# EAGLE design keyboard-tester (EAGLE 7.3.0)
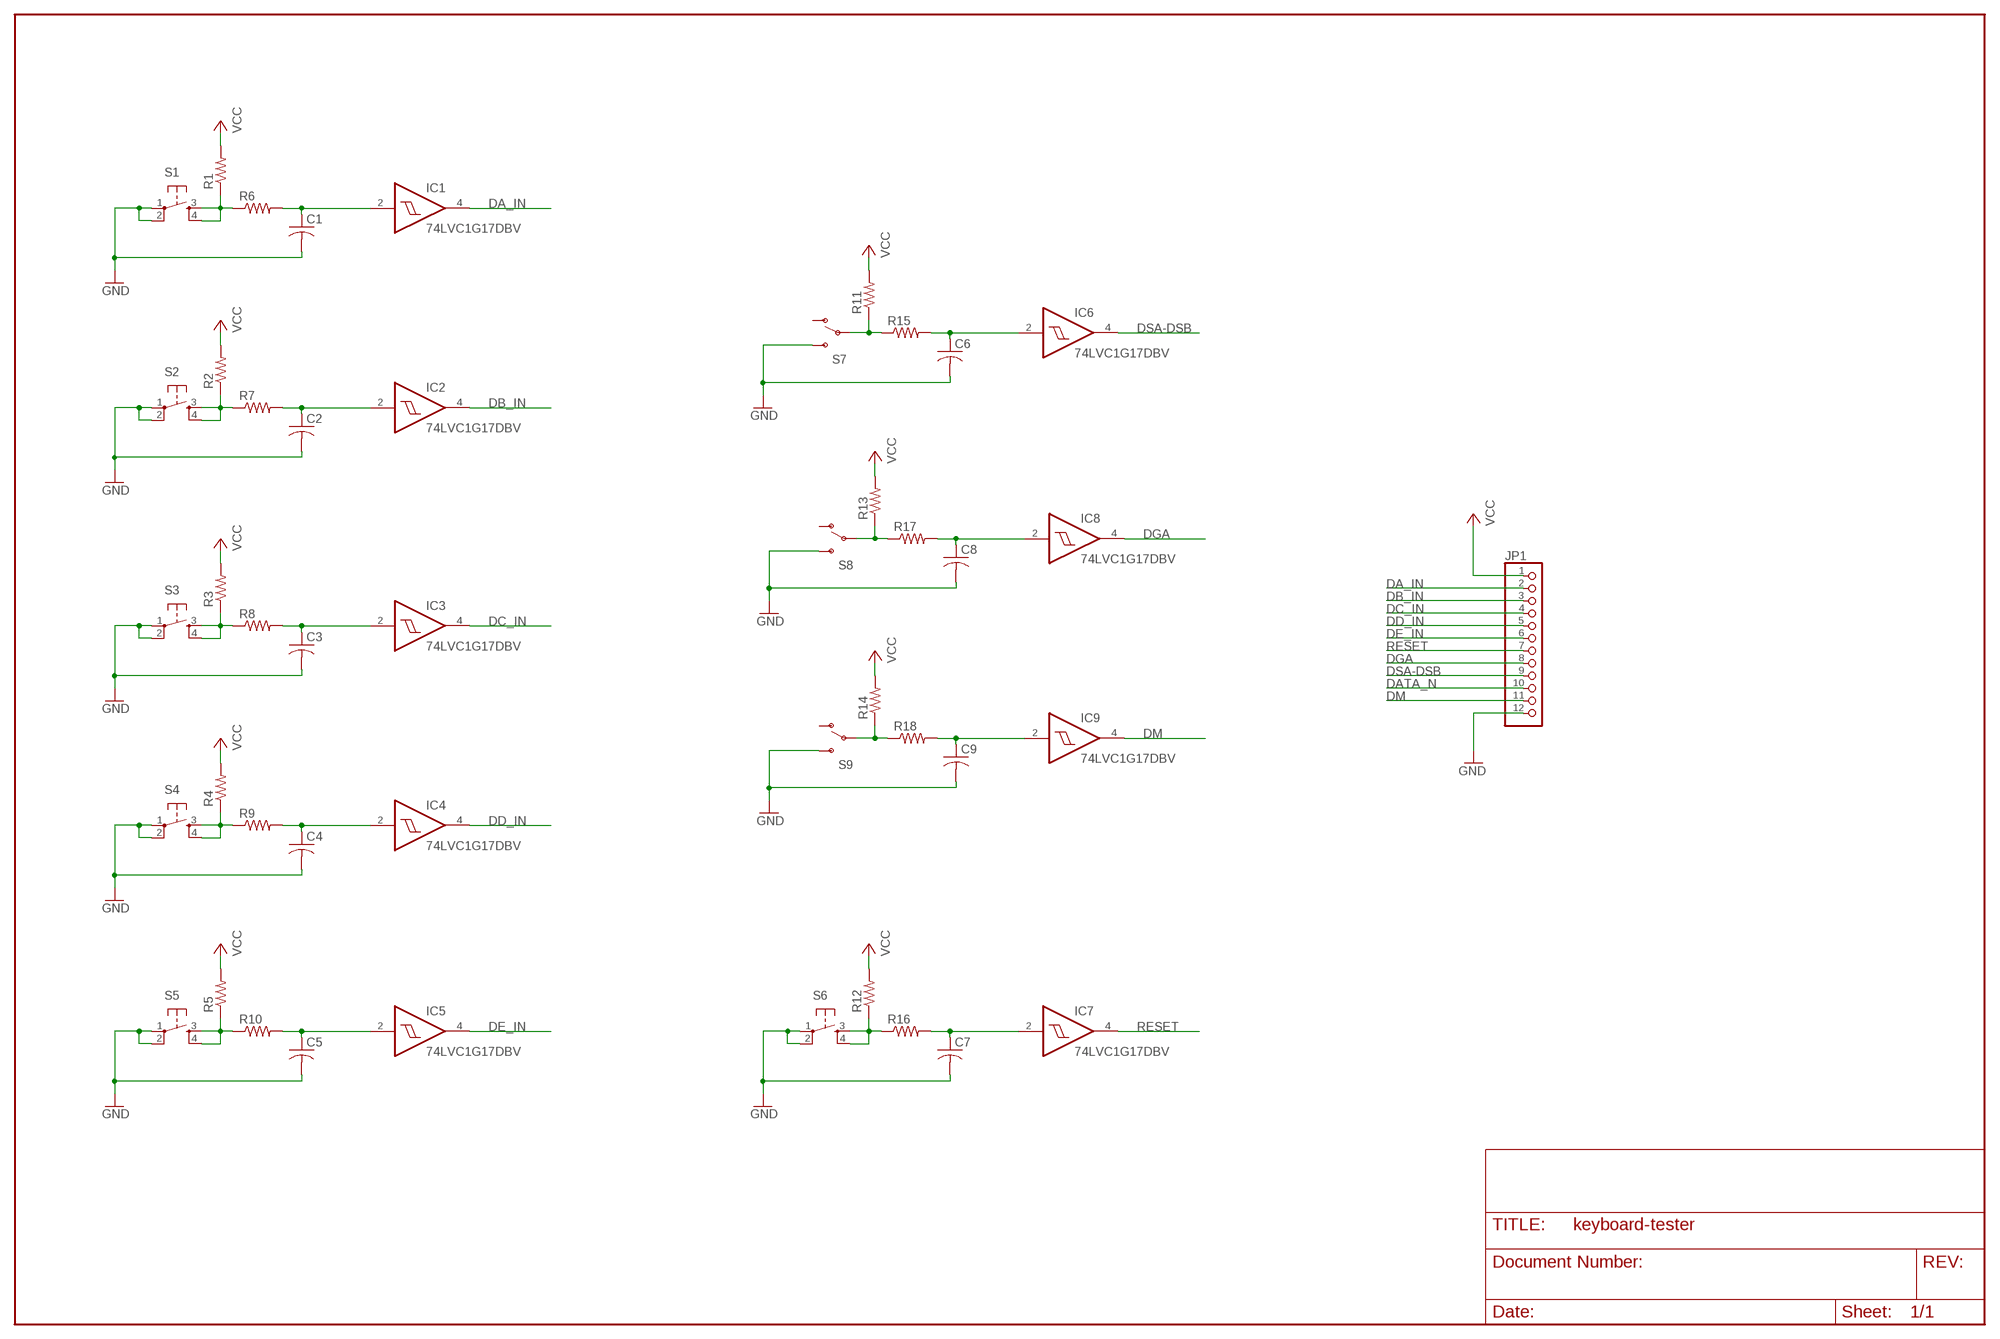
[diagram p0: schematic, sheet 1]

## Parts
C1  C-USC0805  [C0805]
C2  C-USC0805  [C0805]
C3  C-USC0805  [C0805]
C4  C-USC0805  [C0805]
C5  C-USC0805  [C0805]
C6  C-USC0805  [C0805]
C7  C-USC0805  [C0805]
C8  C-USC0805  [C0805]
C9  C-USC0805  [C0805]
IC1  74LVC1G17DBV  [SOT23-5]
IC2  74LVC1G17DBV  [SOT23-5]
IC3  74LVC1G17DBV  [SOT23-5]
IC4  74LVC1G17DBV  [SOT23-5]
IC5  74LVC1G17DBV  [SOT23-5]
IC6  74LVC1G17DBV  [SOT23-5]
IC7  74LVC1G17DBV  [SOT23-5]
IC8  74LVC1G17DBV  [SOT23-5]
IC9  74LVC1G17DBV  [SOT23-5]
JP1  PINHD-1X12  [1X12]
R1  R-US_R0805  [R0805]
R2  R-US_R0805  [R0805]
R3  R-US_R0805  [R0805]
R4  R-US_R0805  [R0805]
R5  R-US_R0805  [R0805]
R6  R-US_R0805  [R0805]
R7  R-US_R0805  [R0805]
R8  R-US_R0805  [R0805]
R9  R-US_R0805  [R0805]
R10  R-US_R0805  [R0805]
R11  R-US_R0805  [R0805]
R12  R-US_R0805  [R0805]
R13  R-US_R0805  [R0805]
R14  R-US_R0805  [R0805]
R15  R-US_R0805  [R0805]
R16  R-US_R0805  [R0805]
R17  R-US_R0805  [R0805]
R18  R-US_R0805  [R0805]
S1  TAC_SWITCHPTH  [TACTILE-PTH]
S2  TAC_SWITCHPTH  [TACTILE-PTH]
S3  TAC_SWITCHPTH  [TACTILE-PTH]
S4  TAC_SWITCHPTH  [TACTILE-PTH]
S5  TAC_SWITCHPTH  [TACTILE-PTH]
S6  TAC_SWITCHPTH  [TACTILE-PTH]
S7  SWITCH-SPDTPTH  [SWITCH-SPDT]
S8  SWITCH-SPDTPTH  [SWITCH-SPDT]
S9  SWITCH-SPDTPTH  [SWITCH-SPDT]

## Nets
DA_IN: IC1.4(O) JP1.2
DATA_N: JP1.10
DB_IN: IC2.4(O) JP1.3
DC_IN: IC3.4(O) JP1.4
DD_IN: IC4.4(O) JP1.5
DE_IN: IC5.4(O) JP1.6
DGA: IC8.4(O) JP1.8
DM: IC9.4(O) JP1.11
DSA-DSB: IC6.4(O) JP1.9
GND: C1.2 C2.2 C3.2 C4.2 C5.2 C6.2 C7.2 C8.2 C9.2 JP1.12 S1.1 S1.2 S2.1 S2.2 S3.1 S3.2 S4.1 S4.2 S5.1 S5.2 S6.1 S6.2 S7.3(S) S8.3(S) S9.3(S)
N$1: R1.1 R6.1 S1.3 S1.4
N$2: C1.1 IC1.2(I) R6.2
N$4: C2.1 IC2.2(I) R7.2
N$5: R2.1 R7.1 S2.3 S2.4
N$6: C3.1 IC3.2(I) R8.2
N$7: R3.1 R8.1 S3.3 S3.4
N$8: C4.1 IC4.2(I) R9.2
N$9: R4.1 R9.1 S4.3 S4.4
N$10: C5.1 IC5.2(I) R10.2
N$11: R5.1 R10.1 S5.3 S5.4
N$12: C7.1 IC7.2(I) R16.2
N$13: R12.1 R16.1 S6.3 S6.4
N$14: C6.1 IC6.2(I) R15.2
N$15: R11.1 R15.1 S7.2(P)
N$16: C8.1 IC8.2(I) R17.2
N$17: R13.1 R17.1 S8.2(P)
N$18: C9.1 IC9.2(I) R18.2
N$19: R14.1 R18.1 S9.2(P)
RESET: IC7.4(O) JP1.7
VCC: JP1.1 R1.2 R2.2 R3.2 R4.2 R5.2 R11.2 R12.2 R13.2 R14.2
Unconnected: S7.1(O) S8.1(O) S9.1(O)

## Power pins joined to a net without a drawn wire
GND: IC1.3(GND) IC2.3(GND) IC3.3(GND) IC4.3(GND) IC5.3(GND) IC6.3(GND) IC7.3(GND) IC8.3(GND) IC9.3(GND)
VCC: IC1.5(VCC) IC2.5(VCC) IC3.5(VCC) IC4.5(VCC) IC5.5(VCC) IC6.5(VCC) IC7.5(VCC) IC8.5(VCC) IC9.5(VCC)

## Library data of the parts
C1-C9 = resistor:C-US: CAPACITOR, American symbol
IC1-IC9 = 74xx-little-us:74*1G17: Single Schmitt-Trigger Buffer
JP1 = pinhead:PINHD-1X12: PIN HEADER
R1-R18 = resistor:R-US_: RESISTOR, American symbol
S1-S6 = SparkFun-Electromechanical:TAC_SWITCH: Momentary Switch Button commonly used for reset or general input. Spark Fun Electronics SKU : COM-00097 SMT- SWCH-08247
S7-S9 = SparkFun-Electromechanical:SWITCH-SPDT: SPDT Switch Simple slide switch, Spark Fun Electronics SKU : COM-00102 DPDT SMT slide switch, AYZ0202, SWCH-08179

## Board
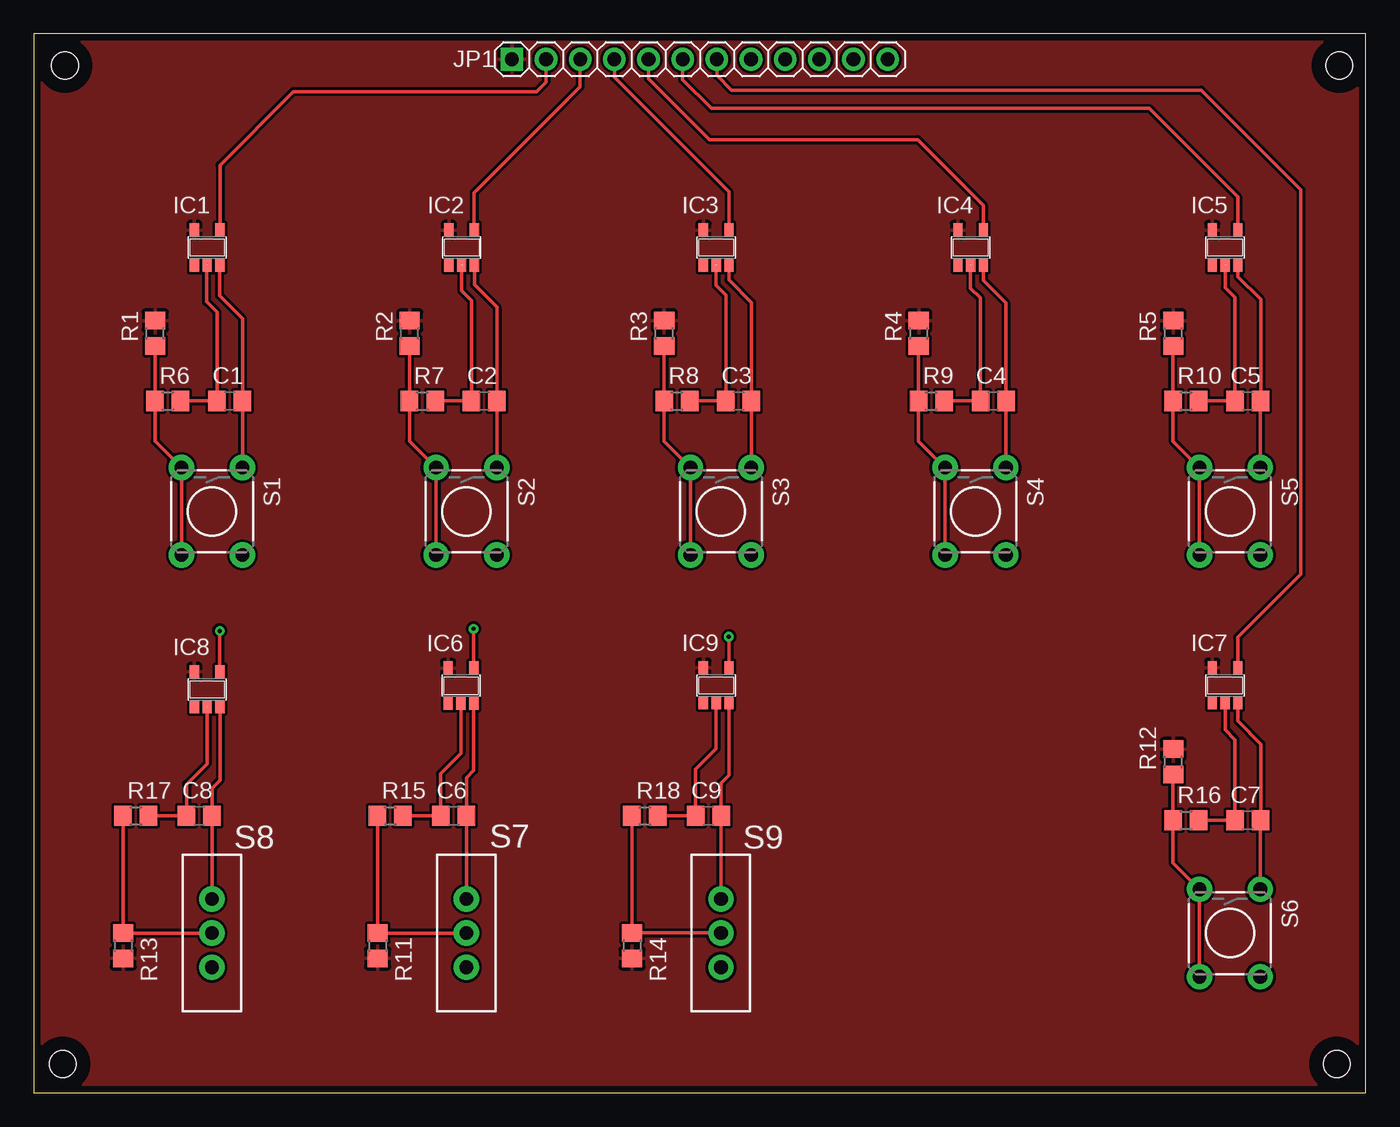
[diagram p1: board, top side]
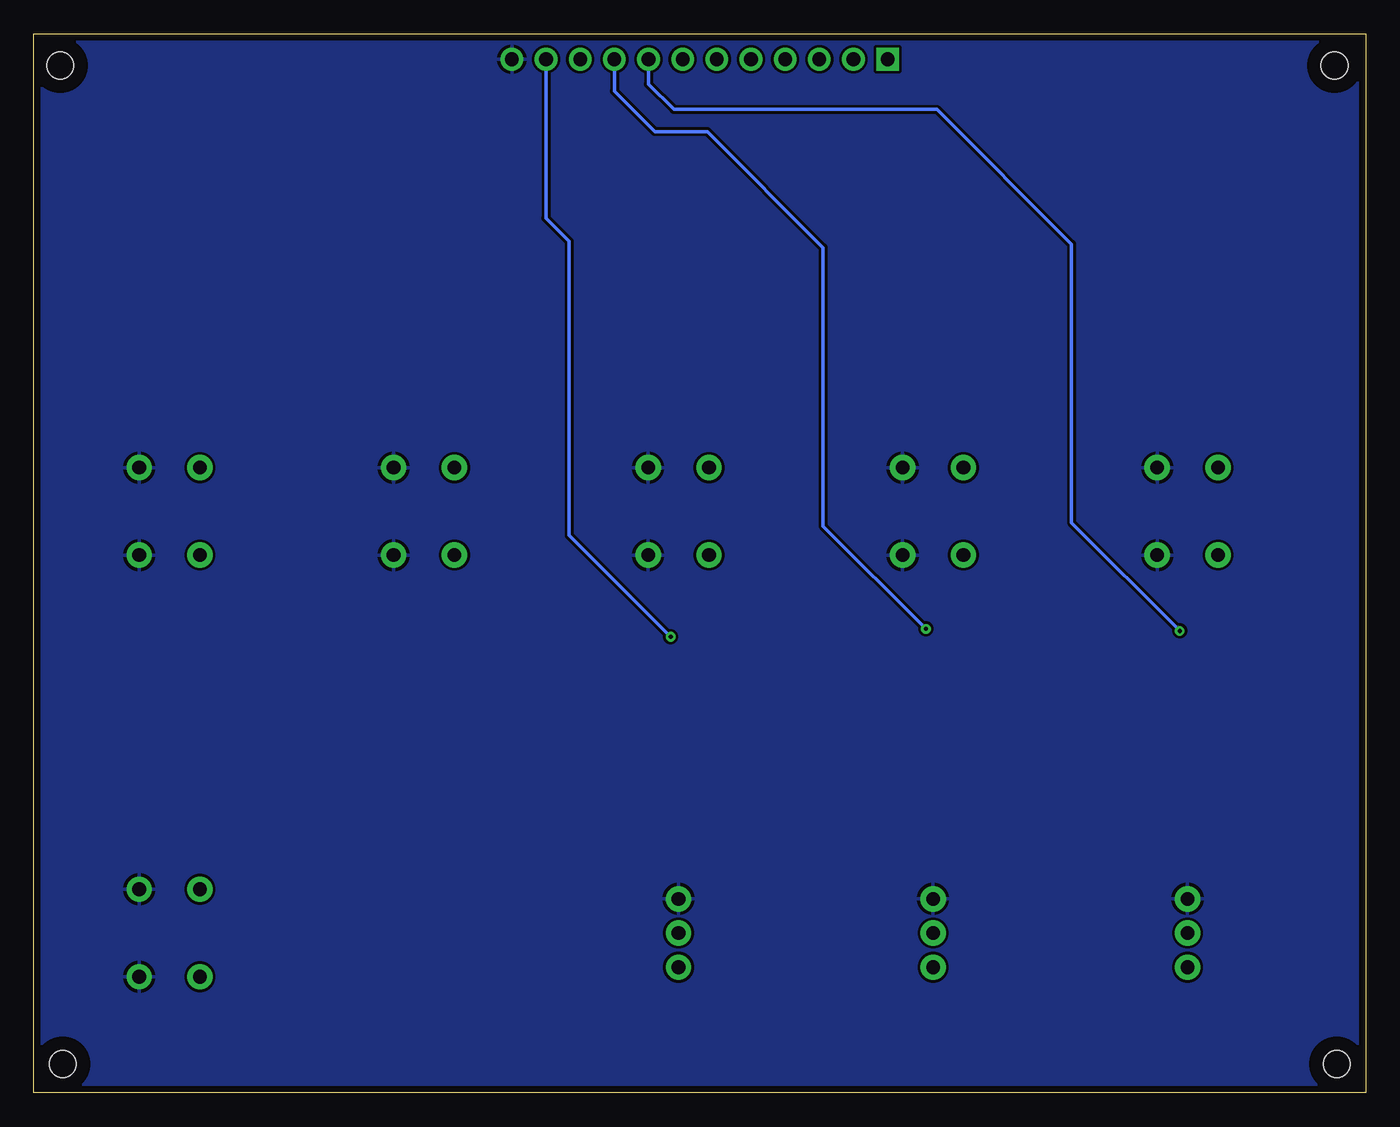
[diagram p2: board, bottom side, seen from below]

Size 99.06 x 78.74 mm. Coordinates in mm from the lower left corner, seen from the top.
Outline: 99.06,78.74 0,78.74 0,0 99.06,0 99.06,78.74
Copper layers (1*16): Top 0.035mm / dielectric 1.5mm / Bottom 0.035mm
Design rules "default *": minimum track width 8mil, minimum drill 12mil, track to track 8mil, track to pad 10mil, pad to pad 10mil, via to via 8mil, smd to smd 8mil, copper to edge 20mil, drill to drill 8mil, minimum pad ring 10mil, minimum via ring 8mil, stop-mask expansion 4mil, vias tented up to drill 0mil, thermal gap 10mil
Holes 2.01 mm at 2.16,2.16 96.9,2.16 97.08,76.38 2.34,76.38
tRestrict: area 94.9,0.2 to 98.9,4.2; area 95.1,74.4 to 99.1,78.4; area 0.3,74.4 to 4.3,78.4; area 0.2,0.2 to 4.2,4.2
bRestrict: area 94.9,0.2 to 98.9,4.2; area 95.1,74.4 to 99.1,78.4; area 0.3,74.4 to 4.3,78.4; area 0.2,0.2 to 4.2,4.2

### Footprints (pad centres in the part's own frame; a part is rotated, then mirrored left to right if it is on the bottom)
C0805 = smd 1.3 x 1.5: 1 -0.95,0; 2 0.95,0
SOT23-5 = smd 0.69 x 0.99: 1 -0.95,-1.29; 2 0,-1.29; 3 0.95,-1.29; 4 0.95,1.3; 5 -0.95,1.3
1X12 = drill 1.016 pad 1.676 square: 1 -13.97,0 | drill 1.016 pad 1.676: 2 -11.43,0; 3 -8.89,0; 4 -6.35,0; 5 -3.81,0; 6 -1.27,0; 7 1.27,0; 8 3.81,0; 9 6.35,0; 10 8.89,0; 11 11.43,0; 12 13.97,0
R0805 = smd 1.3 x 1.5: 1 -0.95,0; 2 0.95,0
TACTILE-PTH = drill 1.016 pad 1.88: 1 -3.251,2.261; 2 3.251,2.261; 3 -3.251,-2.261; 4 3.251,-2.261
SWITCH-SPDT = drill 1.016 pad 1.88: 1 0,2.54; 2 0,0; 3 0,-2.54

### Placement (x,y rotation side)
C1  14.58,51.44 0 top
C2  33.5,51.44 0 top
C3  52.43,51.44 0 top
C4  71.35,51.44 0 top
C5  90.27,51.44 0 top
C6  31.24,20.6 0 top
C7  90.27,20.27 0 top
C8  12.32,20.6 0 top
C9  50.16,20.6 0 top
IC1  12.9,62.84 0 top
IC2  31.83,62.84 0 top
IC3  50.75,62.84 0 top
IC4  69.67,62.84 0 top
IC5  88.6,62.84 0 top
IC6  31.78,30.28 0 top
IC7  88.6,30.3 0 top
IC8  12.9,30 0 top
IC9  50.75,30.3 0 top
JP1  49.53,76.83 0 top
R1  9.04,56.46 90 top
R2  27.97,56.46 90 top
R3  46.89,56.46 90 top
R4  65.81,56.46 90 top
R5  84.73,56.46 90 top
R6  9.98,51.44 0 top
R7  28.91,51.44 0 top
R8  47.83,51.44 0 top
R9  66.75,51.44 0 top
R10  85.67,51.44 0 top
R11  25.58,10.95 270 top
R12  84.73,24.61 90 top
R13  6.65,10.95 270 top
R14  44.5,10.95 270 top
R15  26.52,20.6 0 top
R16  85.67,20.27 0 top
R17  7.59,20.6 0 top
R18  45.44,20.6 0 top
S1  13.26,43.23 270 top
S2  32.18,43.23 270 top
S3  51.1,43.23 270 top
S4  70.03,43.23 270 top
S5  88.95,43.23 270 top
S6  88.95,11.89 270 top
S7  32.18,11.89 180 top
S8  13.26,11.89 180 top
S9  51.1,11.89 180 top

### Tracks (layer width: path | path; a pad name or v marks a point on that pad's centre or on a via)
DA_IN
  Top 0.254: JP1.2 38.1,75.13 37.39,74.42 19.3,74.42 13.85,68.97 IC1.4
DB_IN
  Top 0.254: JP1.3 40.64,74.8 32.77,66.93 32.77,64.15 IC2.4
DC_IN
  Top 0.254: JP1.4 43.18,75.49 51.69,66.98 IC3.4
DD_IN
  Top 0.254: JP1.5 45.72,75.39 50.24,70.87 65.73,70.87 70.61,65.99 IC4.4
DE_IN
  Top 0.254: JP1.6 48.26,75.31 50.39,73.18 82.96,73.18 89.53,66.6 89.53,64.15 IC5.4
DGA  (via drill 0.3 pad 0.3)
  Top 0.254: v13.84,34.34 IC8.4
  Bottom 0.254: JP1.8 53.34,74.98 51.46,73.1 31.9,73.1 21.89,63.09 21.89,42.39 v13.84,34.34
DM  (via drill 0.3 pad 0.3)
  Top 0.254: v51.69,33.91 51.69,31.61 IC9.4
  Bottom 0.254: JP1.11 60.96,65.02 59.23,63.3 59.23,41.45 v51.69,33.91
DSA-DSB  (via drill 0.3)
  Top 0.254: v32.72,34.49 32.72,31.59 IC6.4
  Bottom 0.254: JP1.9 55.88,74.47 52.86,71.45 48.97,71.45 40.36,62.84 40.36,42.14 v32.72,34.49
GND
  Top 0.254: S1.1 15.53,46.49 C1.2 15.53,57.55 13.82,59.26 13.82,61.54 IC1.3 | IC2.3 32.78,60.09 34.44,58.42 C2.2 34.45,46.49 S2.1 | IC3.3 51.7,60.44 53.39,58.75 C3.2 53.38,46.49 S3.1 | S4.1 72.3,46.49 C4.2 72.29,51.45 72.29,58.73 70.62,60.39 IC4.3 | S5.1 91.22,46.49 C5.2 91.24,51.45 91.24,58.98 89.55,60.67 IC5.3 | IC7.3 89.55,27.65 91.26,25.93 91.26,20.31 C7.2 S6.1 | IC9.3 51.7,23.63 51.1,23.04 51.1,20.61 C9.2 51.1,20.59 S9.3 | S8.3 C8.2 13.26,22.66 13.85,23.25 IC8.3 | S7.3 32.18,20.59 C6.2 32.18,23.44 32.73,23.99 IC6.3
  pour Bottom: 99.06,0 0,0 0,78.74 99.06,78.74
N$1
  Top 0.254: R1.1 R6.1 9.03,48.45 S1.3 S1.4
N$2
  Top 0.254: R6.2 C1.1 13.64,58.01 12.85,58.8 12.85,61.52 IC1.2
N$4
  Top 0.254: R7.2 C2.1 32.56,51.45 32.56,58.88 31.83,59.61 IC2.2
N$5
  Top 0.254: R2.1 27.95,55.5 R7.1 27.95,48.45 S2.3 S2.4
N$6
  Top 0.254: R8.2 C3.1 51.49,59.28 50.75,60.02 IC3.2
N$7
  Top 0.254: R3.1 R8.1 | R8.1 | R8.1 46.89,48.44 S3.3 S3.4
N$8
  Top 0.254: R9.2 C4.1 70.38,51.45 70.38,59.11 69.67,59.82 IC4.2
N$9
  Top 0.254: S4.4 S4.3 65.8,48.45 R9.1 R4.1
N$10
  Top 0.254: R10.2 C5.1 89.31,51.45 89.31,59.16 88.59,59.87 IC5.2
N$11
  Top 0.254: S5.4 S5.3 84.72,48.45 R10.1 R5.1
N$12
  Top 0.254: R16.2 C7.1 89.33,20.28 89.33,26.26 88.59,27 IC7.2
N$13
  Top 0.254: R12.1 R16.1 84.72,17.1 S6.3 S6.4
N$14
  Top 0.254: R15.2 C6.1 30.25,20.64 30.25,23.72 31.77,25.25 IC6.2
N$15
  Top 0.254: R15.1 25.58,20.59 R11.1 25.59,11.89 S7.2
N$16
  Top 0.254: R17.2 C8.1 11.38,22.96 12.9,24.49 IC8.2
N$17
  Top 0.254: R17.1 R13.1 6.67,11.89 S8.2
N$18
  Top 0.254: IC9.2 50.75,25.6 49.23,24.08 49.23,20.61 | 49.23,20.61 C9.1 | 49.23,20.61 46.4,20.61 R18.2
N$19
  Top 0.254: R18.1 R14.1 S9.2
RESET
  Top 0.254: JP1.7 50.8,75.64 51.89,74.55 86.82,74.55 94.23,67.13 94.23,38.56 89.53,33.86 89.53,31.61 IC7.4
VCC
  pour Top (rank 2): 99.06,0 0,0 0,78.74 99.06,78.74

### Text on the board
Document: A | B | C | D | E | RESET | DGA | DSA/DSB | DM